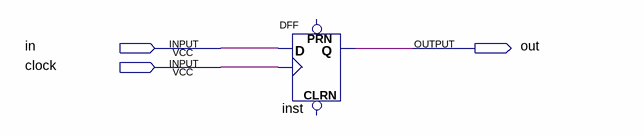
[diagram p0: schematic sheet]
// Quartus schematic Lab2.bdf as structural Verilog: 1 symbols, 3 pins
module Lab2 (
  input  in,
  input  clock,
  output out
);

  DFF inst (.CLK(clock), .D(in), .Q(out));  // open: CLRN, PRN
endmodule
